# Altium project molecule.PrjPcb
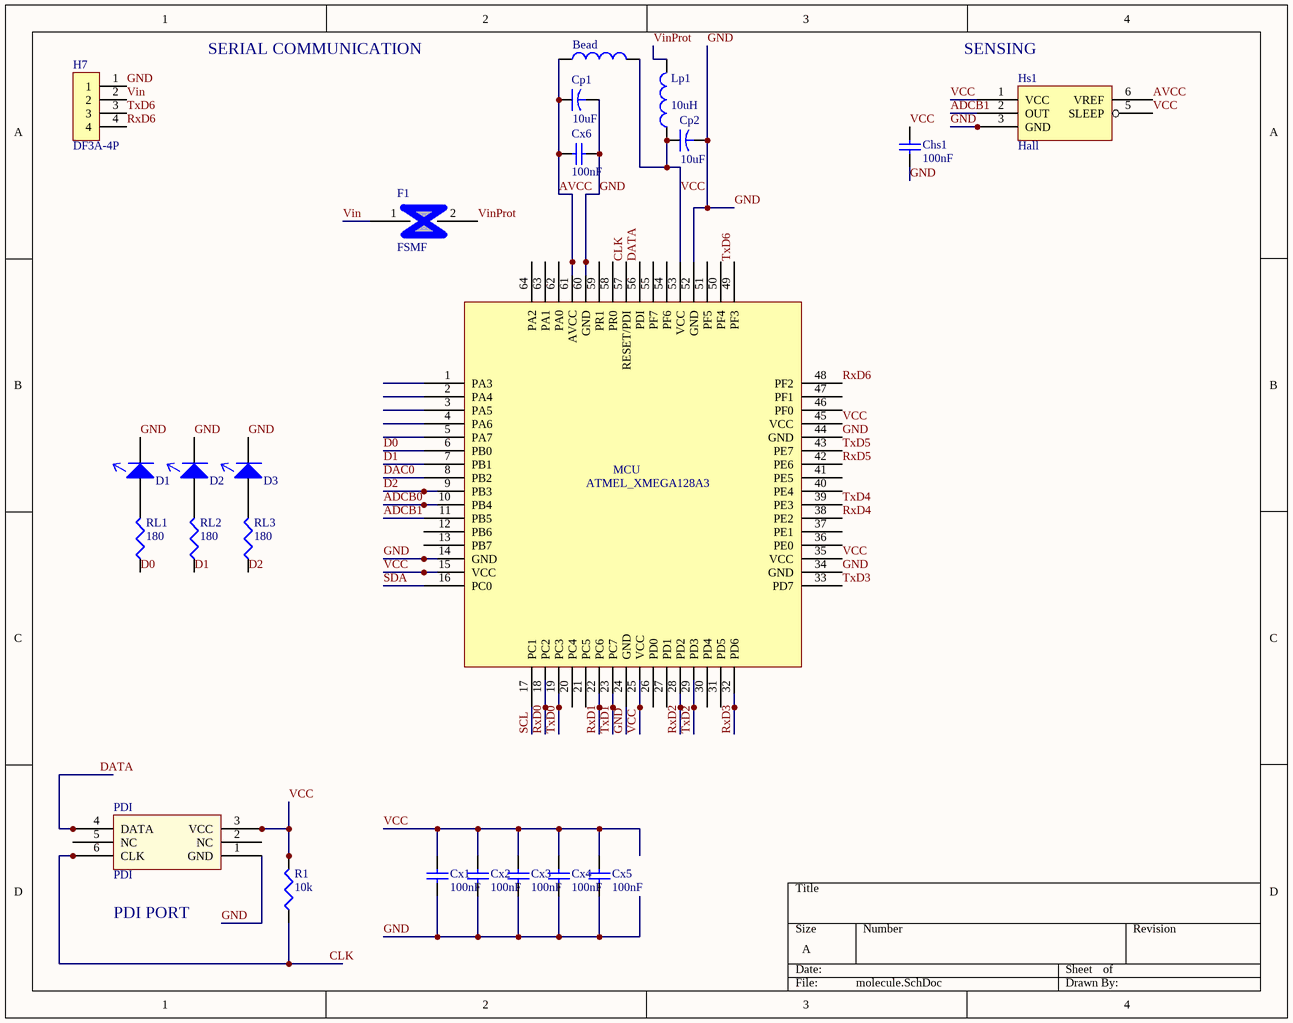
[diagram p0: molecule.SchDoc]
1 sheet, 23 parts. Net scope: global (net labels, ports and power ports of the same name join across sheets).
Board file: molecule.PcbDoc

## Sheet molecule.SchDoc
size A

### Parts
Bead  (no value)  [C0402-DRL]
Chs1  value 100nF  [C0402-DRL]
Cp1  value 10uF  [C0603-DRL]
Cp2  value 10uF  [C0603-DRL]
Cx1  value 100nF  [C0402-DRL]
Cx2  value 100nF  [C0402-DRL]
Cx3  value 100nF  [C0402-DRL]
Cx4  value 100nF  [C0402-DRL]
Cx5  value 100nF  [C0402-DRL]
Cx6  value 100nF  [C0402-DRL]
D1  LEDSMD  [D1206-DRL]  (value not drawn)
D2  LEDSMD  [D1206-DRL]  (value not drawn)
D3  LEDSMD  [D1206-DRL]  (value not drawn)
F1  FSMF  [C0603-DRL]
H7  DF3A-4P  [UART]
Hs1  Hall  [HALL]
Lp1  value 10uH  [C0603-DRL]
MCU  ATMEL_XMEGA128A3  [QFN50P900X900X100-64N]
PDI  PDI  [PDI_SMT]
R1  value 10k  [R0402-DRL]  (hidden comment: R)
RL1  value 180  [R0402-DRL]  (hidden comment: R)
RL2  value 180  [R0402-DRL]  (hidden comment: R)
RL3  value 180  [R0402-DRL]  (hidden comment: R)

### Nets
ADCB0: MCU.10(PB4)
ADCB1: Hs1.2(OUT) MCU.11(PB5)
AVCC: Bead.1 Cp1.1 Cx6.2 Hs1.6(VREF) MCU.61(AVCC)
CLK: MCU.57(RESET/PDI) PDI.6(CLK) R1.1
D0: MCU.6(PB0) RL1.1
D1: MCU.7(PB1) RL2.1
D2: MCU.9(PB3) RL3.1
DAC0: MCU.8(PB2)
DATA: MCU.56(PDI) PDI.4(DATA)
GND: Chs1.1 Cp1.2 Cp2.2 Cx1.1 Cx2.1 Cx3.1 Cx4.1 Cx5.1 Cx6.1 D1.1(K) D2.1(K) D3.1(K) H7.1 Hs1.3(GND) MCU.14(GND) MCU.24(GND) MCU.34(GND) MCU.44(GND) MCU.52(GND) MCU.60(GND) PDI.1(GND)
RxD0: MCU.18(PC2)
RxD1: MCU.22(PC6)
RxD2: MCU.28(PD2)
RxD3: MCU.32(PD6)
RxD4: MCU.38(PE2)
RxD5: MCU.42(PE6)
RxD6: H7.4 MCU.48(PF2)
SCL: MCU.17(PC1)
SDA: MCU.16(PC0)
TxD0: MCU.19(PC3)
TxD1: MCU.23(PC7)
TxD2: MCU.29(PD3)
TxD3: MCU.33(PD7)
TxD4: MCU.39(PE3)
TxD5: MCU.43(PE7)
TxD6: H7.3 MCU.49(PF3)
VCC: Bead.2 Chs1.2 Cp2.1 Cx1.2 Cx2.2 Cx3.2 Cx4.2 Cx5.2 Hs1.1(VCC) Hs1.5(SLEEP) Lp1.1 MCU.15(VCC) MCU.25(VCC) MCU.35(VCC) MCU.45(VCC) MCU.53(VCC) PDI.3(VCC) R1.2
Vin: F1.1 H7.2
VinProt: F1.2 Lp1.2
NetD1_2: D1.2(A) RL1.2
NetD2_2: D2.2(A) RL2.2
NetD3_2: D3.2(A) RL3.2

Not connected (* = marked no-connect by the designer): MCU 1(PA3) 2(PA4) 3(PA5) 4(PA6) 5(PA7) 12(PB6) 13(PB7) 20(PC4) 21(PC5) 26(PD0) 27(PD1) 30(PD4) 31(PD5) 36(PE0) 37(PE1) 40(PE4) 41(PE5) 46(PF0) 47(PF1) 50(PF4) 51(PF5) 54(PF6) 55(PF7) 58(PR0) 59(PR1) 62(PA0) 63(PA1) 64(PA2); PDI 2(NC) 5(NC)

### Notes on the sheet
- SERIAL COMMUNICATION
- (near Hs1) SENSING
- (near PDI) PDI PORT

### Library data of the parts
Bead Lp1 = Inductor: Code_IEC: 1005; Published: 8-Jun-2000; LatestRevisionDate: 29-May-2009; LatestRevisionNote: IPC-7351 Footprint Added.; PackageReference: 0402-A; Publisher: Altium Limited; PackageDescription: Chip Inductor; Code_JEITA: 0402
Chs1 Cx1-Cx6 = Cap: Capacitor; Published: 8-Jun-2000; LatestRevisionDate: 17-Jul-2002; LatestRevisionNote: Re-released for DXP Platform.; PackageReference: RAD-0.3; Publisher: Altium Limited
Cp1 Cp2 = Cap2: Capacitor; Published: 23-Sep-2002; PackageReference: CAPR5-4X5; Publisher: Altium Limited
D1-D3 = LEDSMD: LED
F1 = FSMF: Fuse PTC Reset
H7 = DF3A-4P: 4pin header
Hs1 = Hall: 620-11-ND Hall Effect
MCU = ATMEL_XMEGA128
R1 RL1-RL3 = R: Resistor; Published: 8-Jun-2000; Revision: July-2002: Re-released for DXP Platform.; Publisher: Altium Limited